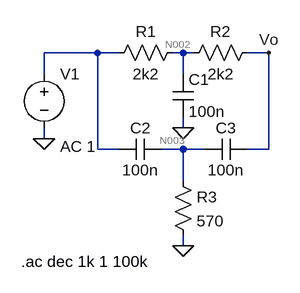
[diagram p0: schematic Notch.asc]
Notch.asc, the LTspice schematic file:
Version 4
SHEET 1 880 680
WIRE 48 112 -32 112
WIRE 80 112 48 112
WIRE 176 112 160 112
WIRE 192 112 176 112
WIRE 304 112 272 112
WIRE -32 144 -32 112
WIRE 176 144 176 112
WIRE 176 224 176 208
WIRE -32 240 -32 224
WIRE 48 256 48 112
WIRE 80 256 48 256
WIRE 176 256 144 256
WIRE 208 256 176 256
WIRE 304 256 304 112
WIRE 304 256 272 256
WIRE 176 304 176 256
WIRE 176 400 176 384
FLAG 176 224 0
FLAG 176 400 0
FLAG -32 240 0
FLAG 304 112 Vo
SYMBOL voltage -32 128 R0
WINDOW 123 24 124 Left 2
WINDOW 39 0 0 Left 0
SYMATTR InstName V1
SYMATTR Value ""
SYMATTR Value2 AC 1
SYMBOL res 176 96 R90
WINDOW 0 0 56 VBottom 2
WINDOW 3 32 56 VTop 2
SYMATTR InstName R1
SYMATTR Value 2k2
SYMBOL res 288 96 R90
WINDOW 0 0 56 VBottom 2
WINDOW 3 32 56 VTop 2
SYMATTR InstName R2
SYMATTR Value 2k2
SYMBOL cap 160 144 R0
SYMATTR InstName C1
SYMATTR Value 100n
SYMBOL cap 144 240 R90
WINDOW 0 0 32 VBottom 2
WINDOW 3 32 32 VTop 2
SYMATTR InstName C2
SYMATTR Value 100n
SYMBOL cap 272 240 R90
WINDOW 0 0 32 VBottom 2
WINDOW 3 32 32 VTop 2
SYMATTR InstName C3
SYMATTR Value 100n
SYMBOL res 160 288 R0
SYMATTR InstName R3
SYMATTR Value 570
TEXT -66 424 Left 2 !.ac dec 1k 1 100k

The netlist it stands for:
* Notch.asc
V1 N001 0 AC 1
R1 N002 N001 2k2
R2 Vo N002 2k2
C1 N002 0 100n
C2 N003 N001 100n
C3 Vo N003 100n
R3 N003 0 570
.ac dec 1k 1 100k
.backanno
.end

* Results of the author's LTspice run, read from the files saved beside the schematic
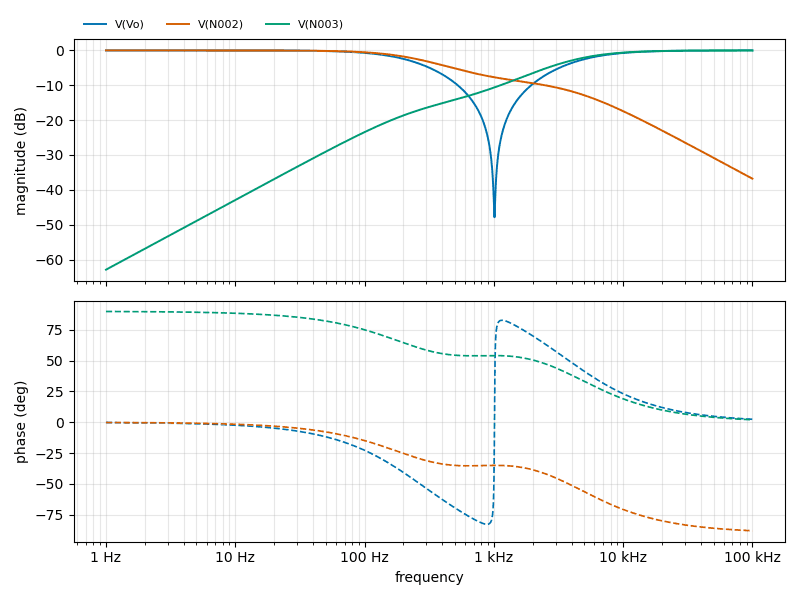
[diagram p1: AC Analysis of Notch.asc, plotted from the saved traces]
* AC Analysis, 1 run:
*   V(Vo): -0.00 dB at 1 Hz, -0.01 dB at 100 kHz, peak -0.00 dB at 1 Hz, 3 dB below the peak at 228 Hz
*   V(N002): -0.00 dB at 1 Hz, -36.80 dB at 100 kHz, peak -0.00 dB at 1 Hz, 3 dB below the peak at 293.8 Hz
*   V(N003): -62.90 dB at 1 Hz, -0.01 dB at 100 kHz, peak -0.01 dB at 100 kHz, 3 dB below the peak at 3.867 kHz